# Altium schematic sheet channel.SchDoc
size 297 x 209 mm; DocumentNumber: 2; SheetNumber: 2; SheetTotal: 2
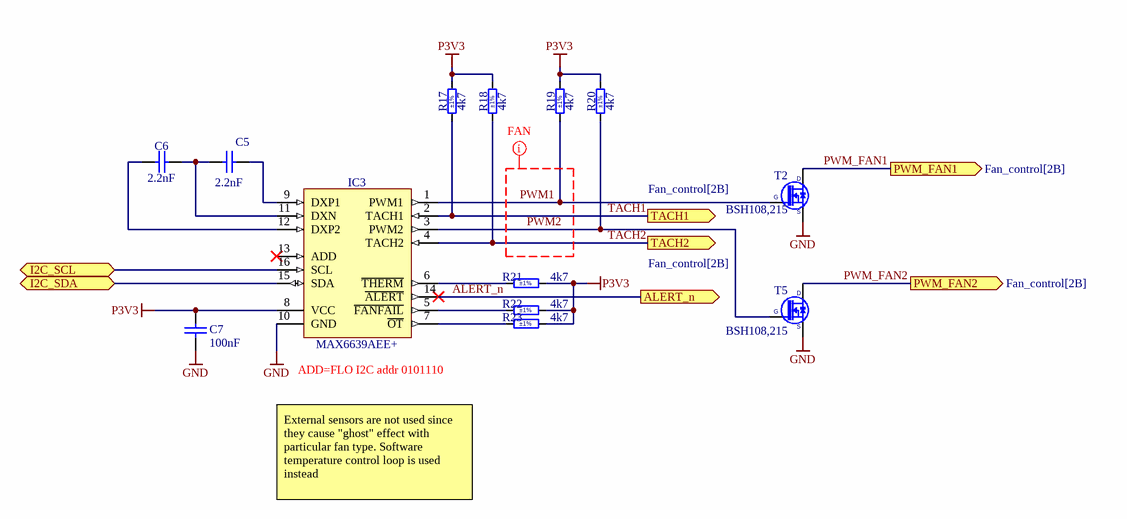
[diagram p0: channel.SchDoc]

## Parts
C5  2.2nF  [CAPC1608X87N]
C6  2.2nF  [CAPC1608X87N]
C7  100nF  [CAPC1608X87N]
IC3  MAX6639AEE+  [SOP63P600X175-16N]
R17  4k7  Tolerance: ±1%  [RESC1005X40N]
R18  4k7  Tolerance: ±1%  [RESC1005X40N]
R19  4k7  Tolerance: ±1%  [RESC1005X40N]
R20  4k7  Tolerance: ±1%  [RESC1005X40N]
R21  4k7  Tolerance: ±1%  [RESC1005X40N]
R22  4k7  Tolerance: ±1%  [RESC1005X40N]
R23  4k7  Tolerance: ±1%  [RESC1005X40N]
T2  BSH108,215  [SOT95P230X110-3N]
T5  BSH108,215  [SOT95P230X110-3N]

## Ports
ALERT_n (out, see Fan_control[1B]), I2C_SCL (bidir, see Fan_control[1B]), I2C_SDA (bidir, see Fan_control[1B]), PWM_FAN1 (out, see Fan_control[2B]), PWM_FAN2 (out, see Fan_control[2B]), TACH1 (out, see Fan_control[2B]), TACH2 (out, see Fan_control[2B])

## Nets
GND: C7.1 IC3.10(GND) T2.2(S) T5.2(S)
P3V3: C7.2 IC3.8(VCC) R17.2 R18.2 R19.2 R20.2 R21.2 R22.2 R23.2
ALERT_n: IC3.14(~{ALERT}) ; port ALERT_n
I2C_SCL: IC3.16(SCL) ; port I2C_SCL
I2C_SDA: IC3.15(SDA) ; port I2C_SDA
PWM1: IC3.1(PWM1) R19.1 T2.1(G)
PWM2: IC3.3(PWM2) R20.1 T5.1(G)
PWM_FAN1: T2.3(D) ; port PWM_FAN1
PWM_FAN2: T5.3(D) ; port PWM_FAN2
TACH1: IC3.2(TACH1) R17.1 ; port TACH1
TACH2: IC3.4(TACH2) R18.1 ; port TACH2
NetC5_1: C5.1 IC3.9(DXP1)
NetC5_2: C5.2 C6.2 IC3.11(DXN)
NetC6_1: C6.1 IC3.12(DXP2)
NetIC3_5: IC3.5(~{FANFAIL}) R22.1
NetIC3_6: IC3.6(~{THERM}) R21.1
NetIC3_7: IC3.7(~{OT}) R23.1

Not connected (* = marked no-connect by the designer): IC3 13(ADD)*

## Layout directives
net class FAN: PWM1, PWM2

## Notes on the sheet
- (near IC3) ADD=FLO I2C addr 0101110
- External sensors are not used since they cause "ghost" effect with particular fan type. Software temperature control loop is used instead
- Project/Equipment
- Document
- Designer
- Drawn by
- Check.by
- Last Mod.
- Copyright WUT ISE 2024.
  This documentation describes Open Hardware and is licensed under the CERN OHL v.1.1. You may redistribute and modify this documentation under the terms of the CERN OHL v.1.1. (http://ohwr.org/CERNOHL). This documentation is distributed WITHOUT ANY EXPRESS OR IMPLIED WARRANTY, INCLUDING OF MERCHANTABILITY, SATISFACTORY QUALITY AND FITNESS FOR A PARTICULAR PURPOSE. Please see the CERN OHL v.1.1 for applicable conditions.
- Contact
- File
- Print Date
- Sheet
- Size
- A4
- of
- Rev

## Library data of the parts
C5 C6 = CC0603_2.2NF_50V_10%_X7R: Non-polarised capacitor; Part Description: SMD Multilayer Chip Ceramic Capacitor; Manufacturer: GENERIC; Manufacturer1 Part Number: 223858615627; Voltage: 50V; TC: X7R; Tolerance: ±10%; Part Number: CC0603_2.2NF_50V_10%_X7R; Component Kind: Standard; Component Type: Standard; Pin Count: 2; Value: 2.2nF; Status: Preferred; Manufacturer Part Number: CC0603_2.2NF_50V_10%_X7R; Case: 0603; Mounted: Yes; Socket: No; SMD: Yes; Sense: No; Manufacturer1 Example: PHYCOMP; Manufacturer1 ComponentHeight: 0.87mm; HelpURL: \\cern.ch\dfs\Applications\Altium\Datasheets\CC0603_X7R_PHYCOMP.pdf; Author: CERN DEM JLC; CreateDate: 03.12.2007; LatestRevisionDate: 03.12.2007
C7 = CC0603_100NF_50V_10%_X5R: Non-polarised capacitor; Part Description: SMD Multilayer Chip Ceramic Capacitor; Manufacturer: GENERIC; Manufacturer1 Part Number: C1608X5R1H104K080; Voltage: 50V; TC: X5R; Tolerance: ±10%; Part Number: CC0603_100NF_50V_10%_X5R; Component Kind: Standard; Component Type: Standard; Pin Count: 2; Value: 100nF; Status: None; Manufacturer Part Number: CC0603_100NF_50V_10%_X5R; Case: 0603; Mounted: Yes; Socket: No; SMD: Yes; Sense: No; Manufacturer1 Example: TDK; Manufacturer1 ComponentHeight: 0.9mm; HelpURL: \\cern.ch\dfs\Applications\Altium\Datasheets\CC0603_X5R_TDK_C.pdf; Author: CERN DEM MR; CreateDate: 08.01.2016; LatestRevisionDate: 08.01.2016
IC3 = MAX6639AEE+: 2-Channel Temperature Monitor with Dual, Automatic, PWM Fan-Speed Controller; Manufacturer: MAXIM; PressFit: No; Bonding: No; Part Number: MAX6639AEE+; Component Kind: Standard; Component Type: Standard; Device: MAX6639AEE+; PackageDescription: SOP, 0.635mm Pitch; 16 Pin, 3.9mm W X 4.895mm L X 1.75mm H body, IPC Medium Density; Part Description: 2-Channel Temperature Monitor with Dual, Automatic, PWM Fan-Speed Controller; Manufacturer Part Number: MAX6639AEE; Pin Count: 16; Case: SSOP16; Mounted: Yes; Socket: No; SMD: Yes; ComponentHeight: 1.75mm; Author: CERN DEM JLC; HelpURL: \\cern.ch\dfs\Applications\Altium\Datasheets\MAX6639AEE+.pdf; CreateDate: 15.08.2012; LatestRevisionDate: 04.04.2022; Sense: No
R17-R23 = R0402_4K7_1%_0.0625W_100PPM: Resistor - 1%; Part Description: General Purpose Thick Film Chip Resistor; Manufacturer: GENERIC; Manufacturer1 Part Number: 232270674702L; TC: ±100ppm/°C; PressFit: No; Part Number: R0402_4K7_1%_0.0625W_100PPM; Component Kind: Standard; Component Type: Standard; Pin Count: 2; Value: 4k7; Status: Not Recommended; Power: 0.0625W; Manufacturer Part Number: R0402_4K7_1%_0.0625W_100PPM; Case: 0402; Mounted: Yes; Sense: No; Socket: No; SMD: Yes; Manufacturer1 Example: YAGEO PHYCOMP; Manufacturer1 ComponentHeight: 0.4mm; HelpURL: \\cern.ch\dfs\Applications\Altium\Datasheets\R0402_Phycomp_RC0402.pdf; Author: CERN DEM JLC; CreateDate: 03.12.2007; LatestRevisionDate: 17.10.2012
T2 T5 = BSH108: MOSFET N-CH 30V 1.9A TO236AB; Part Number: BSH108,215; Device: BSH108,215